# Altium schematic sheet Sensores2.SchDoc: EXTERNAL BOARD SENSORS
size A; DrawnBy: Diego Gomez Canales; DocumentNumber: SCH-4; Revision: 1.0; SheetNumber: 4; SheetTotal: 4; ProjectName: CISCO AP
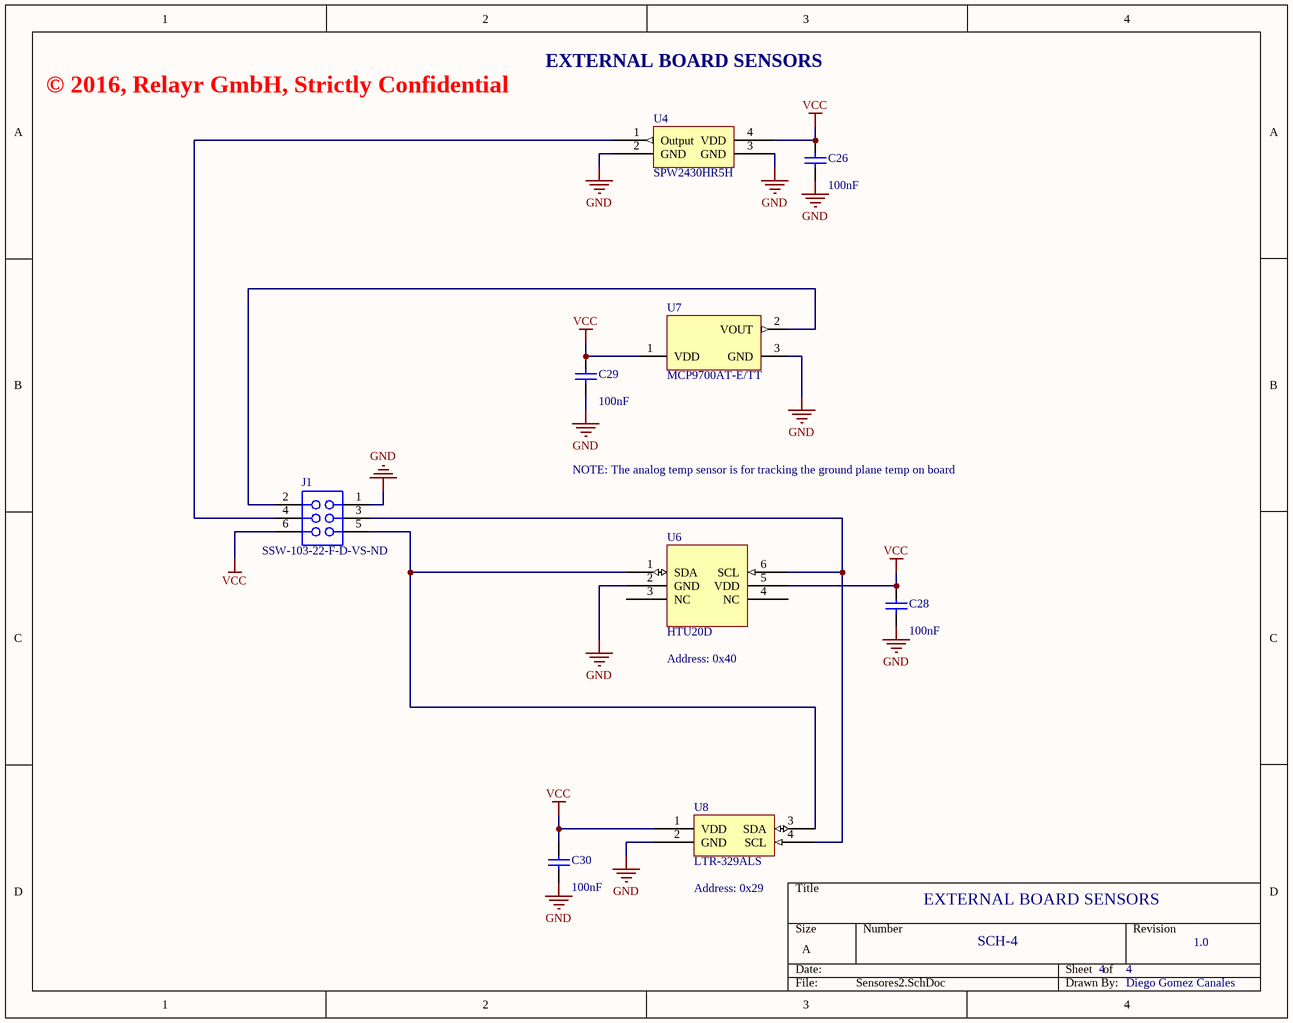
[diagram p0: Sensores2.SchDoc]

## Parts
C26  value 100nF  [6-0805_N]  (hidden comment: Cap)
C28  value 100nF  [6-0805_N]  (hidden comment: Cap)
C29  value 100nF  [6-0805_N]  (hidden comment: Cap)
C30  value 100nF  [6-0805_N]  (hidden comment: Cap)
J1  Supplier Part Number 1: SSW-103-22-F-D-VS-ND  [SMTC-SSW-103-22-X-S-VS]  (hidden comment: SMTC-SSW-103-01-X-D)
U4  SPW2430HR5H  [DFN3127P600-8N]
U6  HTU20D  [HTU20D_DFN6]
U7  MCP9700AT-E/TT  [SOT-23-TT3_L]
U8  LTR-329ALS  [ChipLED4Pin2X2X07]

## Nets
GND: C26.1 C28.1 C29.1 C30.1 J1.1 U4.2(GND) U4.3(GND) U6.2(GND) U7.3(GND) U8.2(GND)
VCC: C26.2 C28.2 C29.2 C30.2 J1.6 U4.4(VDD) U6.5(VDD) U7.1(VDD) U8.1(VDD)
NetJ1_2: J1.2 U7.2(VOUT)
NetJ1_3: J1.3 U6.6(SCL) U8.4(SCL)
NetJ1_4: J1.4 U4.1(Output)
NetJ1_5: J1.5 U6.1(SDA) U8.3(SDA)

Not connected (* = marked no-connect by the designer): U6 3(NC) 4(NC)

## Notes on the sheet
- © 2016, Relayr GmbH, Strictly Confidential
- EXTERNAL BOARD SENSORS
- NOTE: The analog temp sensor is for tracking the ground plane temp on board
- Address: 0x40
- (near U8) Address: 0x29

## Library data of the parts
C26 C28-C30 = Cap: Capacitor; Published: 8-Jun-2000; LatestRevisionDate: 17-Jul-2002; LatestRevisionNote: Re-released for DXP Platform.; PackageReference: RAD-0.3; Publisher: Altium Limited; PackageDescription: Radial Cap, Thru-Hole; 2 Leads; 0.3 in Pin Spacing; Supplier 1: Digi-Key; Supplier Part Number 1: 399-1170-2-ND
U4 = SPW2430HR5H: Knowles MEMS Microphone; Supplier 1: Digi-Key; Supplier Part Number 1: 423-1394-1-ND
U6 = HTU20D: Digital relative Humidity sensor with temperature output; Supplier 1: Digi-Key; Supplier Part Number 1: 223-1592-1-ND
U7 = CMP-0192-00218-1: Low-Power Linear Active Thermistor IC, 3-Pin SOT-23, Extended Temperature, Tape and Reel; PackageReference: SOT-23-TT3; PackageVersion: revBB, Aug-2009; DatasheetVersion: revE, Apr-2009; Code_IPC: SOT23-3; PackageDescription: 3-Lead Plastic Small Outline Transistor (TT) [SOT-23]; Supplier 1: Digi-Key; Supplier Part Number 1: MCP9700AT-E/TTCT-ND
U8 = LTR-329ALS: Digital Ambient Light Sensor; Supplier 1: Digi-Key; Supplier Part Number 1: 160-2160-1-ND
J1 = SMTC-SSW-103-01-X-D: Supplier 1: Digi-Key